# Altium schematic sheet MC_Sch2.SchDoc
size A4
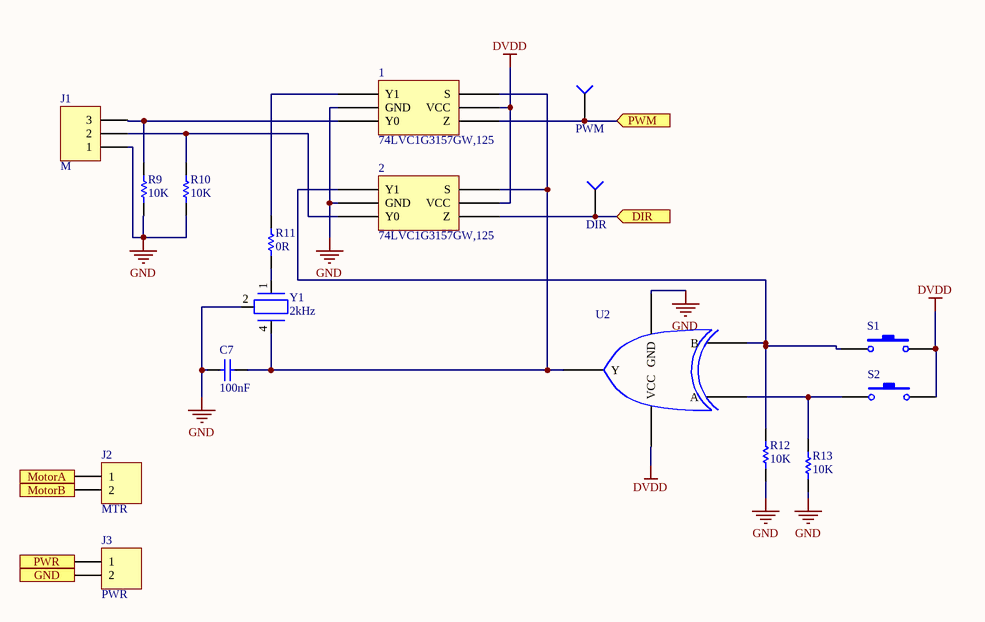
[diagram p0: MC_Sch2.SchDoc]

## Parts
1  74LVC1G3157GW,125  [IC MUX/DEMUX]
2  74LVC1G3157GW,125  [IC MUX/DEMUX]
C7  value 100nF  [CAPC0603(1608)55_N]  (hidden comment: CAP_10nF_0603)
J1  M  [HDR1X3]
J2  MTR  [OSTYK51102030]
J3  PWR  [OSTYK51102030]
R9  value 10K  [RESC0603(1608)_N]  (hidden comment: RES_10K_0603)
R10  value 10K  [RESC0603(1608)_N]  (hidden comment: RES_10K_0603)
R11  value 0R  [RESC0603(1608)_N]  (hidden comment: RES_0R_0603)
R12  value 10K  [RESC0603(1608)_N]  (hidden comment: RES_10K_0603)
R13  value 10K  [RESC0603(1608)_N]  (hidden comment: RES_10K_0603)
S1  SW_PWR  [PTS830GM140]  (value not drawn)
S2  SW_PWR  [PTS830GM140]  (value not drawn)
TP5  PWM  [TESTPOINT_LOOP]
TP6  DIR  [TESTPOINT_LOOP]
U2  SN74AHC1G02DBVT  [SOT23-5]  (value not drawn)
Y1  2kHz  [CDFN-4]

## Ports
DIR (in), GND (in), MotorA (in), MotorB (in), PWM (in), PWR (in)

## Nets
DVDD: 1.5(VCC) 2.5(VCC) S1.2 S2.2 U2.5(VCC)
GND: 1.2(GND) 2.2(GND) C7.2 J1.1 R9.1 R10.1 R12.1 R13.1 U2.3(GND) Y1.2(GND)
DIR: 2.4(Z) TP6.1(=value) ; port DIR
GND: J3.2 ; port GND  [a separate net that carries the same name]
MotorA: J2.1 ; port MotorA
MotorB: J2.2 ; port MotorB
PWM: 1.4(Z) TP5.1(=value) ; port PWM
PWR: J3.1 ; port PWR
Net1_1: 1.1(Y1) R11.2
Net1_3: 1.3(Y0) J1.3 R9.2
Net1_6: 1.6(S) 2.6(S) C7.1 U2.4(Y) Y1.4(VDD)
Net2_1: 2.1(Y1) R12.2 S1.1 U2.2(B)
Net2_3: 2.3(Y0) J1.2 R10.2
NetR11_1: R11.1 Y1.1(OUT)
NetR13_2: R13.2 S2.1 U2.1(A)

## Library data of the parts
1 2 = IC MUX/DEMUX 2x1: Manufacturer: NXP Semiconductors; Min Supply Voltage: 1.65V; Max Supply Voltage: 5.5V; Number of Channels: 1; Bandwidth: 300MHz; Propagation Delay: 1ns; Max Power Dissipation: 250mW; On-State Resistance: 15R; Turn-On Delay Time: 8.7ns; Turn-Off Delay Time: 6ns; Operating Supply Current: 40uA; Number of Inputs: 2; Logic Function: Demultiplexer,Demux,Multiplexer,Mux; Supply Type: Single; Supplier 1: Digi-Key; Manufacturer Part Number: 74LVC1G3157GW,125; Stock 1: 109219; Pricing 1: 1=0.37, 10=0.276, 100=0.156, 500=0.10332, 1000=0.07921 (USD); Mount: Surface Mount; Case/Package: TSSOP; Number of Pins: 6; Min Operating Temperature: -40°C; Max Operating Temperature: 125°C; Packaging: Tape and Reel; Package Quantity: 3000; Number of Outputs: 1; Power Dissipation: 250mW; Number of Circuits: 1; Radiation Hardening: No; Lead Free: Lead Free; REACH SVHC: No SVHC; ComponentLink1URL: http://www.nxp.com/documents/data_sheet/74LVC1G3157.pdf?src-supplier=Avnet; ComponentLink1Description: http://www.nxp.com/documents/data_sheet/74LVC1G3157.pdf?src-supplier=Avnet; ComponentLink2URL: https://www.verical.com/server-webapp/html/getDatasheet?partID=347929&src-supplier=Verical; ComponentLink2Description: https://www.verical.com/server-webapp/html/getDatasheet?partID=347929&src-supplier=Verical; ComponentLink3URL: http://www.nxp.com/documents/data_sheet/74LVC1G3157.pdf?src-supplier=Avnet+Asia; ComponentLink3Description: http://www.nxp.com/documents/data_sheet/74LVC1G3157.pdf?src-supplier=Avnet+Asia; ComponentLink4URL: http://www.nxp.com/documents/data_sheet/74LVC1G3157.pdf?src-supplier=Digi-Key; ComponentLink4Description: http://www.nxp.com/documents/data_sheet/74LVC1G3157.pdf?src-supplier=Digi-Key; ComponentLink5URL: http://www.nxp.com/documents/data_sheet/74LVC1G3157.pdf?src-supplier=Avnet+Europe; ComponentLink5Description: http://www.nxp.com/documents/data_sheet/74LVC1G3157.pdf?src-supplier=Avnet+Europe; Supplier Part Number 1: 1727-6073-6-ND
C7 = CAP_10nF_0603: CAP CER 10000PF 16V X7R 0603; MPN: CC0603KRX7R7BB103; Manufacturer: Yageo; Dimensions: 0.063" L x 0.031" W (1.60mm x 0.80mm); Package: 0603 (1608 Metric); Temperature Coefficient: X7R; Voltage Rating: 16V; Digikey Part Number: 311-3369-1-ND
J1 = Header 3: Header, 3-Pin; LatestRevisionDate: 17-Jul-2002; LatestRevisionNote: Re-released for DXP Platform.; Publisher: Altium Limited
J2 J3 = TERMINAL_2: Header, 2-Pin; LatestRevisionDate: 17-Jul-2002; LatestRevisionNote: Re-released for DXP Platform.; Publisher: Altium Limited
R9 R10 R12 R13 = RES_10K_0603: RES SMD 10K OHM 5% 1/10W 0603; Manufacturer: Yageo; MPN: RC0603JR-0710KL; Package: 0603 (1608 Metric); Dimensions: 0.063" L x 0.031" W (1.60mm x 0.80mm); Tolerance: 5%; Digikey Part Number: 311-10KGRCT-ND
R11 = RES_0R_0603: RES SMD 0 OHM JUMPER 1/10W 0603; Manufacturer: Yageo; MPN: RC0603JR-070RL; Package: 0603 (1608 Metric); Dimensions: 0.063" L x 0.031" W (1.60mm x 0.80mm); Digikey Part Number: 311-0.0GRCT-ND
S1 S2 = SW_PWR: Power Switch (Red); pin to pad: 2>4; MPN: PTS830GM140 SMTR LFS; Manufacturer: C&K; ComponentLink1Description: Datasheet; ComponentLink1URL: https://www.ckswitches.com/media/1478/pts830.pdf; Digikey Part Number: CKN10587CT-ND
TP5 TP6 = *: TESTPOINT_SMD; Part Number (MPN): *
U2 = IC GATE XOR: Manufacturer: Texas Instruments; Max Supply Voltage: 5.5V; Min Supply Voltage: 2V; Logic Function: NOR; Quiescent Current: 1uA; Propagation Delay: 7.5ns; Number of Outputs: 1; Number of Inputs: 2; Low Level Output Current: 8mA; High Level Output Current: -8mA; Turn-On Delay Time: 8.5ns; Manufacturer Part Number: SN74AHC1G02DBVT; Mount: Surface Mount; Case/Package: SOT-23; Number of Pins: 5; Weight: 0.000557oz; Min Operating Temperature: -40°C; Max Operating Temperature: 125°C; Packaging: Tape and Reel; Package Quantity: 250; Number of Gates: 1; Number of Input Lines: 2; Number of Output Lines: 1; Number of Circuits: 1; Number of Elements: 1; Number of Bits: 1; Output Current: 8mA; Max Output Current: 8mA; Termination: SMD/SMT; Radiation Hardening: No; Lead Free: Lead Free; REACH SVHC: No SVHC; ComponentLink1URL: http://www.ti.com/lit/ds/symlink/sn74ahc1g02.pdf?src-supplier=Digi-Key; ComponentLink1Description: http://www.ti.com/lit/ds/symlink/sn74ahc1g02.pdf?src-supplier=Digi-Key; ComponentLink2URL: http://focus.ti.com/lit/ds/symlink/sn74ahc1g02.pdf?src-supplier=Avnet+Europe; ComponentLink2Description: http://focus.ti.com/lit/ds/symlink/sn74ahc1g02.pdf?src-supplier=Avnet+Europe; ComponentLink3URL: http://www.farnell.com/datasheets/1786933.pdf?src-supplier=Element14; ComponentLink3Description: http://www.farnell.com/datasheets/1786933.pdf?src-supplier=Element14; Supplier 1: Digi-Key; Supplier Part Number 1: 296-1094-1-ND
Y1 = OSC_2kHz: OSCILLATOR_2kHz; Supplier 1: Digi-Key; Supplier Part Number 1: DSC6083CI2A-002K000-ND